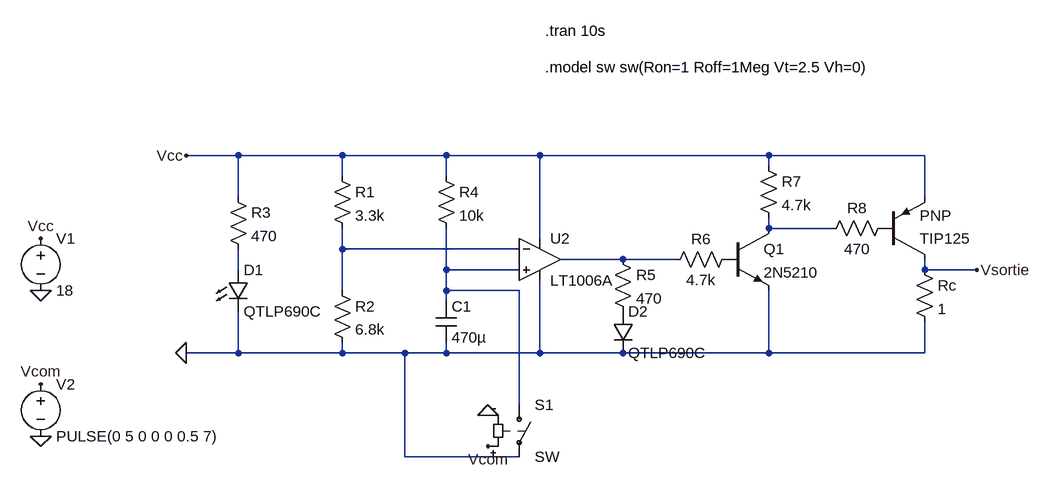
[diagram p0: schematic Alim.asc]
Alim.asc, the LTspice schematic file:
Version 4
SHEET 1 1620 680
WIRE 384 0 304 0
WIRE 544 0 384 0
WIRE 704 0 544 0
WIRE 848 0 704 0
WIRE 1200 0 848 0
WIRE 1440 0 1200 0
WIRE 1200 16 1200 0
WIRE 544 32 544 0
WIRE 704 32 704 0
WIRE 384 64 384 0
WIRE 1440 64 1440 0
WIRE 1200 112 1200 96
WIRE 1296 112 1200 112
WIRE 848 128 848 0
WIRE 544 144 544 112
WIRE 816 144 544 144
WIRE 976 160 880 160
WIRE 1056 160 976 160
WIRE 384 176 384 144
WIRE 704 176 704 112
WIRE 816 176 704 176
WIRE 1440 176 1440 160
WIRE 1520 176 1440 176
WIRE 544 208 544 144
WIRE 704 208 704 176
WIRE 816 208 704 208
WIRE 704 224 704 208
WIRE 384 304 384 240
WIRE 384 304 304 304
WIRE 544 304 544 288
WIRE 544 304 384 304
WIRE 640 304 544 304
WIRE 704 304 704 288
WIRE 704 304 640 304
WIRE 848 304 848 192
WIRE 848 304 704 304
WIRE 976 304 848 304
WIRE 1200 304 1200 208
WIRE 1200 304 976 304
WIRE 1440 304 1440 256
WIRE 1440 304 1200 304
WIRE 816 384 816 208
WIRE 640 464 640 304
WIRE 816 464 640 464
FLAG 80 208 0
FLAG 80 128 Vcc
FLAG 304 304 0
FLAG 304 0 Vcc
FLAG 1520 176 Vsortie
FLAG 80 432 0
FLAG 80 352 Vcom
FLAG 768 448 Vcom
FLAG 768 400 0
SYMBOL voltage 80 112 R0
WINDOW 123 0 0 Left 0
WINDOW 39 0 0 Left 0
SYMATTR InstName V1
SYMATTR Value 18
SYMBOL res 368 48 R0
SYMATTR InstName R3
SYMATTR Value 470
SYMBOL LED 368 176 R0
SYMATTR InstName D1
SYMATTR Value QTLP690C
SYMATTR Description Diode
SYMATTR Type diode
SYMBOL res 528 16 R0
SYMATTR InstName R1
SYMATTR Value 3.3k
SYMBOL res 528 192 R0
SYMATTR InstName R2
SYMATTR Value 6.8k
SYMBOL res 688 16 R0
SYMATTR InstName R4
SYMATTR Value 10k
SYMBOL cap 688 224 R0
SYMATTR InstName C1
SYMATTR Value 470µ
SYMBOL res 960 144 R0
SYMATTR InstName R5
SYMATTR Value 470
SYMBOL diode 960 240 R0
SYMATTR InstName D2
SYMATTR Value QTLP690C
SYMBOL res 1152 144 R90
WINDOW 0 0 56 VBottom 2
WINDOW 3 32 56 VTop 2
SYMATTR InstName R6
SYMATTR Value 4.7k
SYMBOL npn 1136 112 R0
SYMATTR InstName Q1
SYMATTR Value 2N5210
SYMBOL res 1184 0 R0
SYMATTR InstName R7
SYMATTR Value 4.7k
SYMBOL res 1392 96 R90
WINDOW 0 0 56 VBottom 2
WINDOW 3 32 56 VTop 2
SYMATTR InstName R8
SYMATTR Value 470
SYMBOL pnp 1376 160 M180
SYMATTR InstName TIP125
SYMBOL OpAmps\\LT1006A 848 96 R0
SYMATTR InstName U2
SYMBOL sw 816 368 R0
SYMATTR InstName S1
SYMBOL voltage 80 336 R0
WINDOW 123 0 0 Left 0
WINDOW 39 0 0 Left 0
SYMATTR InstName V2
SYMATTR Value PULSE(0 5 0 0 0 0.5 7)
SYMBOL res 1424 160 R0
SYMATTR InstName Rc
SYMATTR Value 1
TEXT 856 -192 Left 2 !.tran 10s
TEXT 856 -136 Left 2 !.model sw sw(Ron=1 Roff=1Meg Vt=2.5 Vh=0)

The netlist it stands for:
* Alim.asc
V1 Vcc 0 18
R3 Vcc N004 470
D1 N004 0 QTLP690C
R1 Vcc N002 3.3k
R2 N002 0 6.8k
R4 Vcc N005 10k
C1 N005 0 470µ
R5 N003 P001 470
D2 P001 0 QTLP690C
R6 P002 N003 4.7k
Q1 N001 P002 0 0 2N5210
R7 Vcc N001 4.7k
R8 P003 N001 470
Q§TIP125 Vsortie P003 Vcc 0 PNP
XU2 N005 N002 Vcc 0 N003 LT1006A  ; pins In+ In- V+ V- OUT
S1 N005 0 Vcom 0 SW
V2 Vcom 0 PULSE(0 5 0 0 0 0.5 7)
Rc Vsortie 0 1
.model D D
.lib standard.dio
.model NPN NPN
.model PNP PNP
.lib standard.bjt
.tran 10s
.model sw sw(Ron=1 Roff=1Meg Vt=2.5 Vh=0)
.backanno
.end